# Altium schematic sheet Power.SchDoc
size A
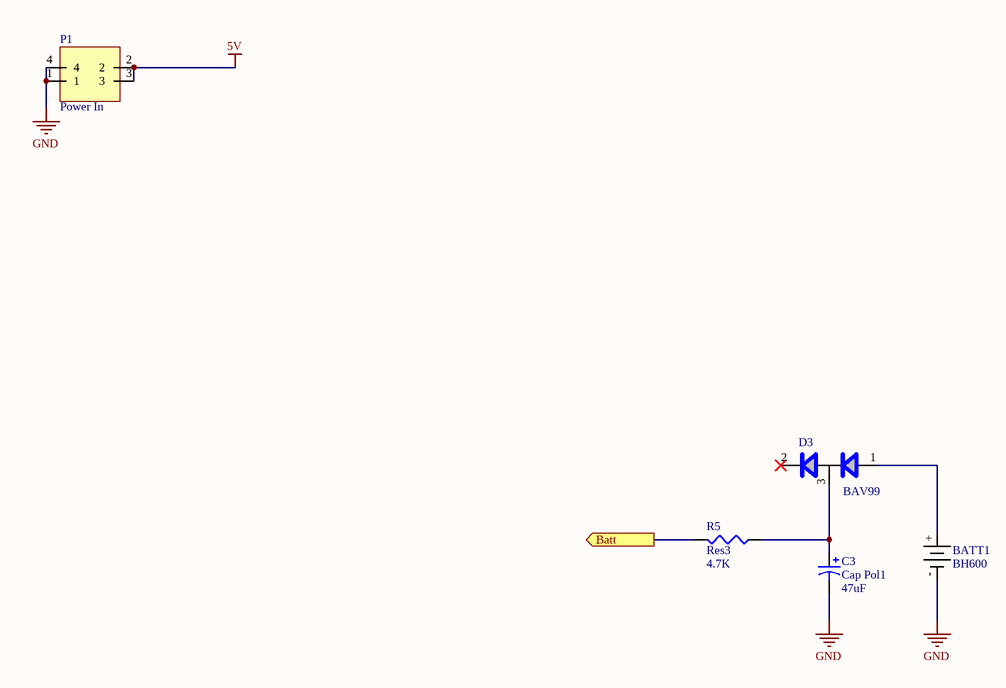
[diagram p0: Power.SchDoc]

## Parts
BATT1  BH600  [BH600]
C3  Cap Pol1  value 47uF  [CAPPR5-5x5]
D3  BAV99  [SOT23]
P1  Power In  [0039300040 MINI-FIT JR 4-Pos Right Angle]
R5  Res3  value 4.7K  [J1-0603]

## Ports
Batt (out)

## Nets
5V: P1.2 P1.3
GND: BATT1.- C3.2 P1.1 P1.4
Batt: R5.2 ; port Batt
NetBATT1_+: BATT1.+ D3.1
NetC3_1: C3.1 D3.3 R5.1

Not connected (* = marked no-connect by the designer): D3 2*

## Library data of the parts
BATT1 = BH600: 16mm Battery Holder - Memory Protection Devices; Supplier Part #: BH600-ND; Supplier: DigiKey
C3 = Cap Pol1: Polarized Capacitor (Radial); Published: 8-Jun-2000; LatestRevisionDate: 17-Jul-2002; LatestRevisionNote: Re-released for DXP Platform.; PackageReference: RB7.6-15; Publisher: Altium Limited; Supplier Part #: P5137-ND; Supplier: DigiKey
D3 = BAV99: Dual Surface Mount Switching Diode; Model: BAV99-7-F; Supplier Part #: BAV99-FDICT-ND; Supplier: DigiKey
P1 = 0039300040 Mini-Fit 2x2 Right Angle: Supplier Part #: WM21352-ND; Supplier: DigiKey
R5 = Res3: Resistor; Published: 8-Jun-2000; LatestRevisionDate: 04-Mar-2005; LatestRevisionNote: PCB Footprint replaced.; PackageReference: J1-0603; Publisher: Altium Limited; Supplier Part #: P4.7KGCT-ND; Supplier: DigiKey